# EasyEDA Pro project 快慢上掉电自动化_3.eprj, board PCB1
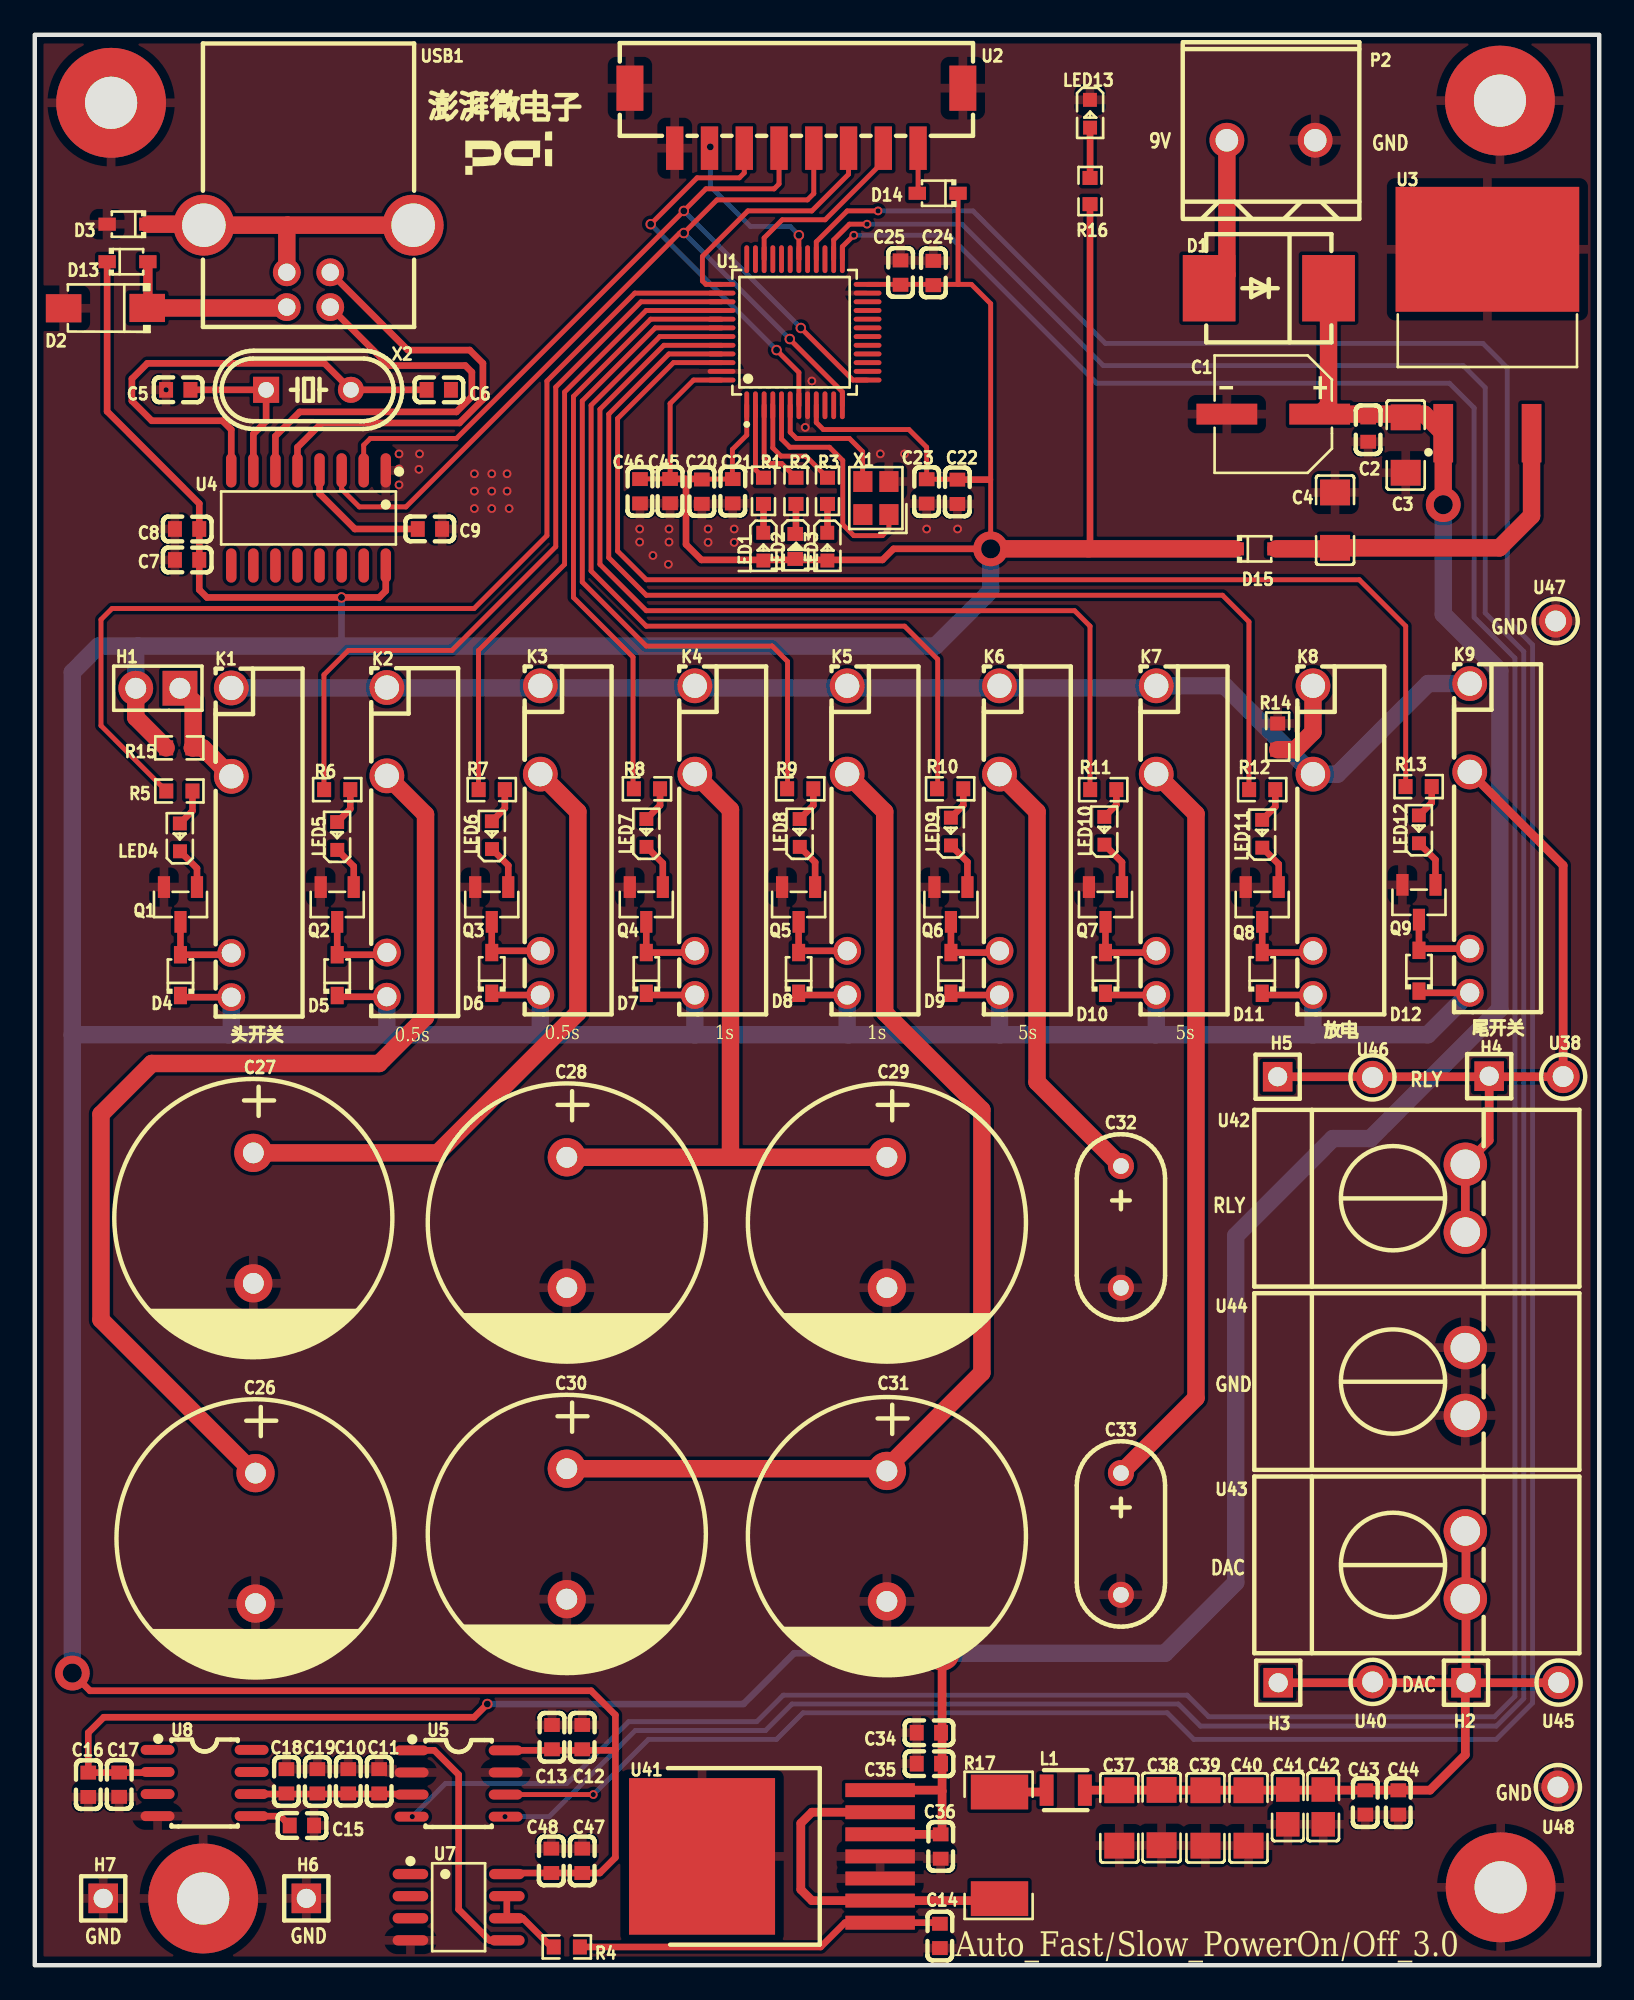
[diagram p6: board, top side]
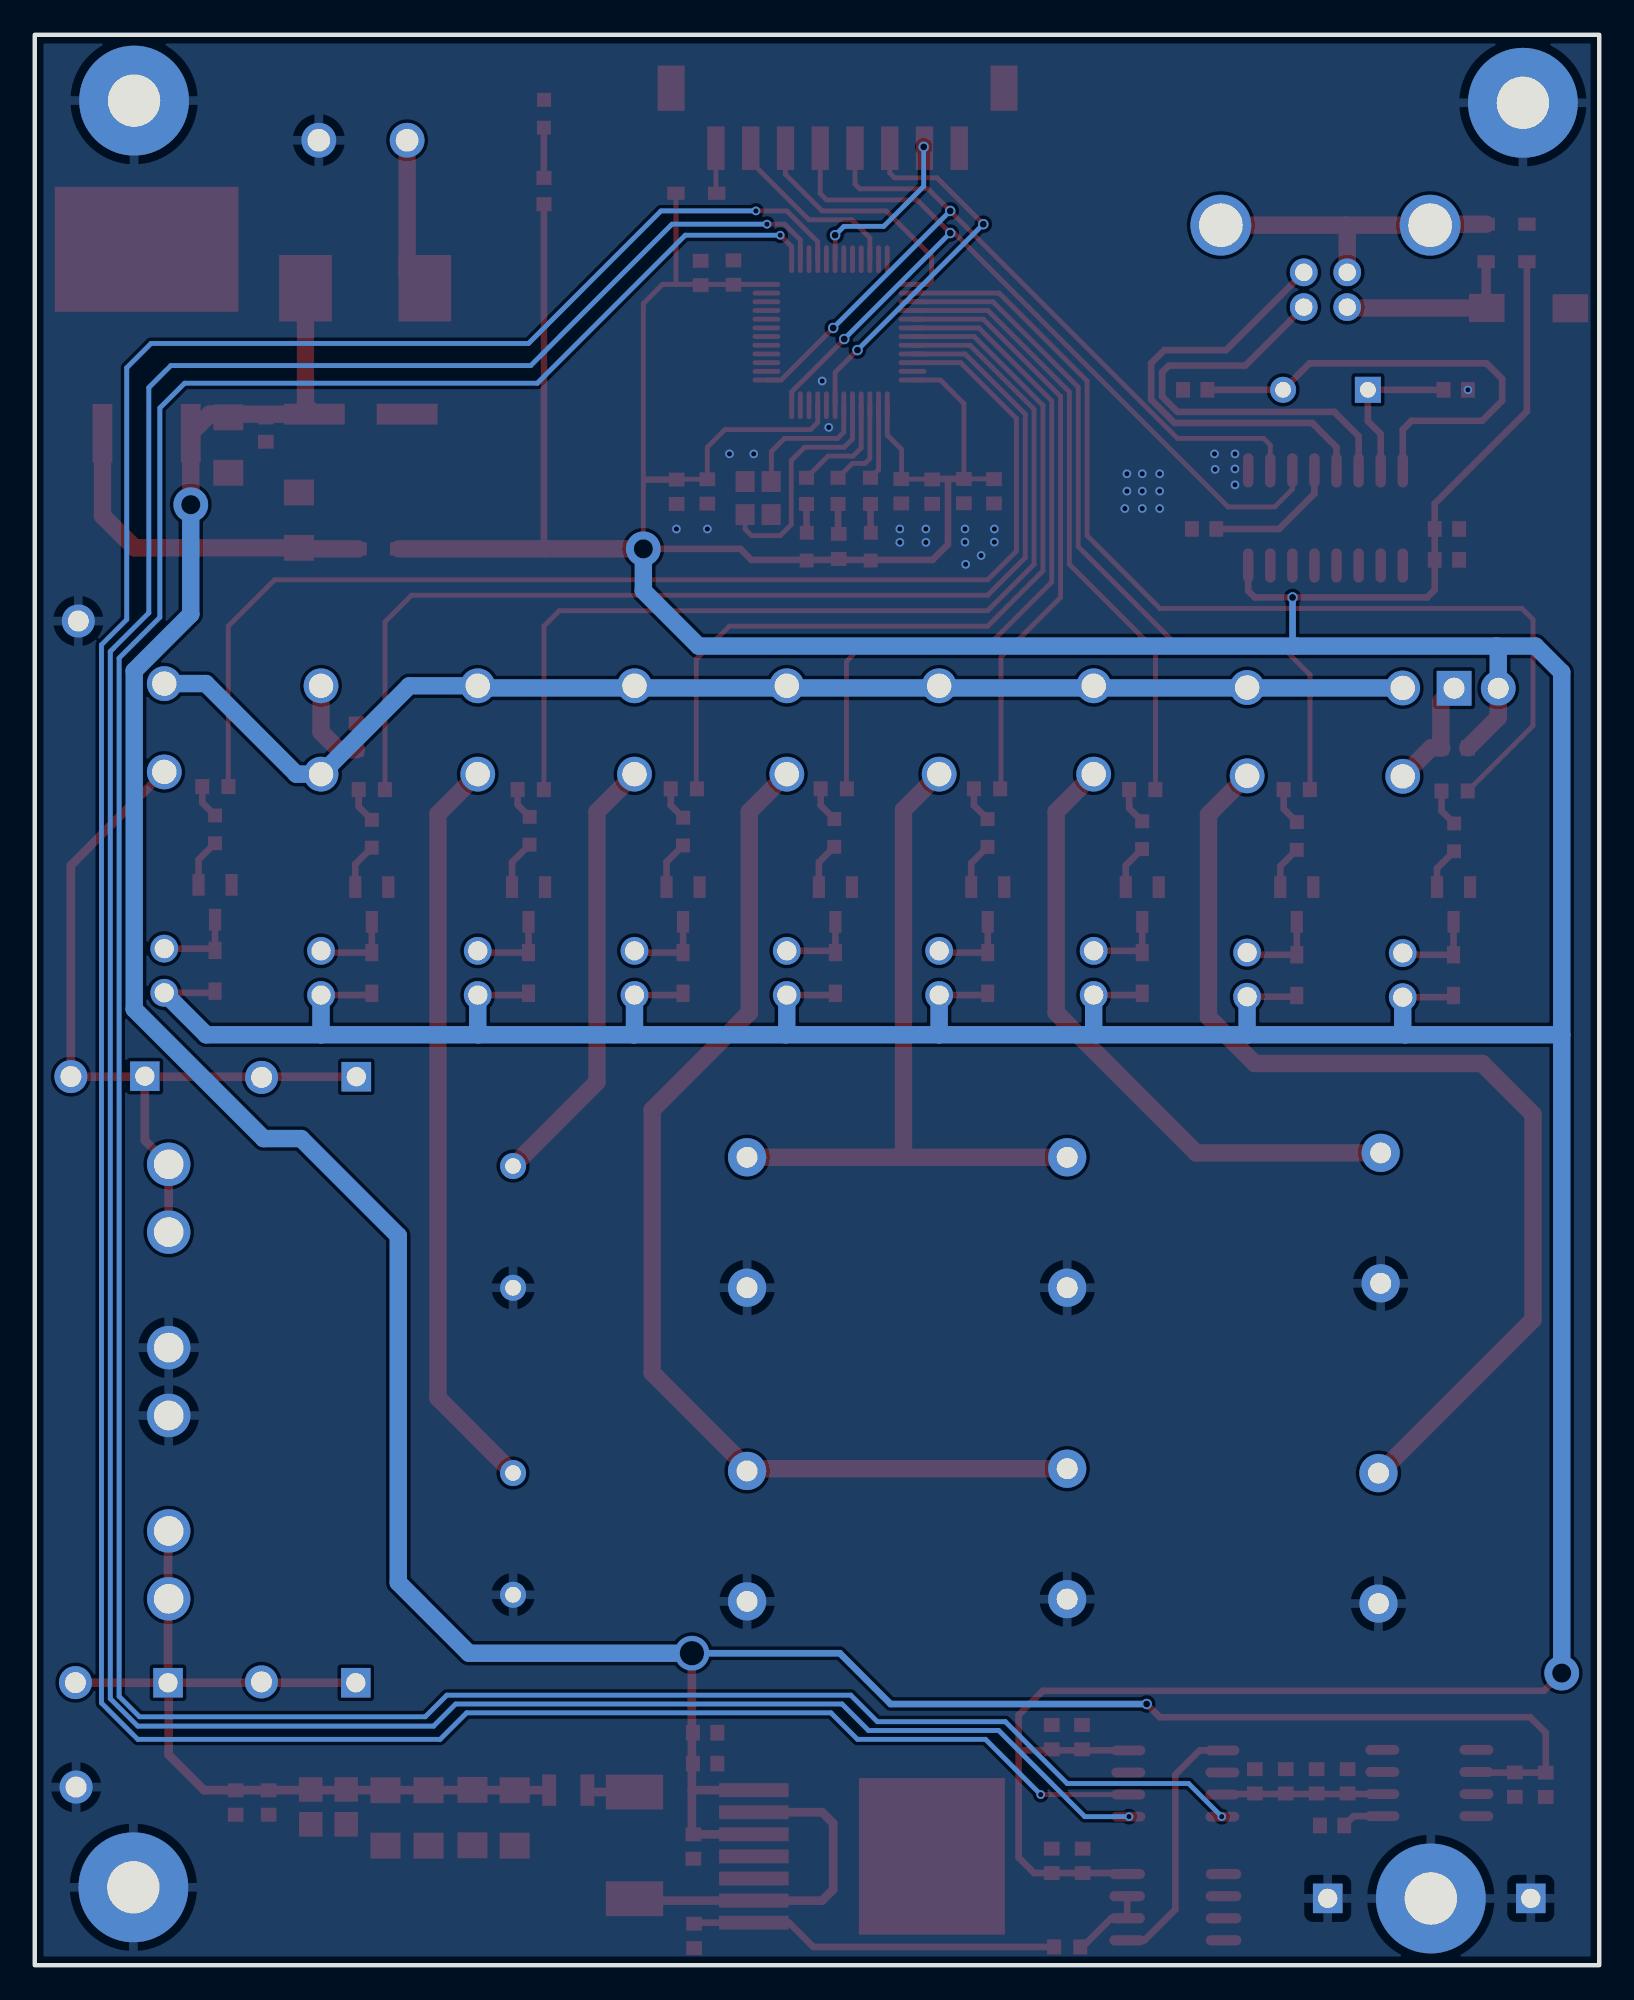
[diagram p7: board, bottom side, seen from below]

Outline 90 x 111 mm; copper layers: Top Layer, Bottom Layer. Coordinates in mm from the lower left corner of the outline.
Outline path: rectangle 0,111 90,0
Stack: Top Layer 0.035mm / Dielectric1 1.51mm FR4 er 4.5 / Bottom Layer 0.035mm

## Design rules (mm)
template: 自定义配置
spacing copperThickness1oz (default): track to track 0.102, other pairs 0.152 to 0.3
spacing copperThickness2oz: track to track 0.203, other pairs 0.152 to 0.3
track width copperThickness1oz (default): min 0.127, default 0.254, max 2.54
track width copperThickness2oz: min 0.203, default 0.254, max 2.54
differential pair differentialPair (default): width min 0.127, default 0.254, max 2.54; gap min 0.152, default 0.152
via viaSize (default): diameter min 0.5, default 0.61, max 10; hole min 0.3, default 0.305, max 6.3

## Placement (name value [footprint] x y rotation side)
C1  100uF  [CAP-SMD_BD6.3-L6.6-W6.6-LS7.6-FD-1]  71.25 89.19 180 top
C2  100nF  [C0603]  76.71 88.3 90 top
C3  10uF  [C1206]  78.87 87.41 90 top
C4  10uF  [C1206]  74.8 83.09 270 top
C5  22pF  [C0603]  8.25 90.58 0 top
C6  22pF  [C0603]  23.24 90.58 180 top
C7  100nF  [C0603]  8.76 80.81 180 top
C8  10uF  [C0603]  8.76 82.58 180 top
C9  100nF  [C0603]  22.73 82.58 0 top
C10  10uF  [C0603]  18.03 10.57 270 top
C11  100nF  [C0603]  19.81 10.57 270 top
C12  10uF  [C0603]  31.5 13.11 90 top
C13  100nF  [C0603]  29.75 13.11 90 top
C14  100nF  [C0603]  52.07 1.68 90 top
C15  1uF  [C0603]  15.37 8.03 180 top
C16  10uF  [C0603]  3.08 10.37 270 top
C17  100nF  [C0603]  4.86 10.38 270 top
C18  10uF  [C0603]  14.48 10.57 90 top
C19  1uF  [C0603]  16.26 10.57 90 top
C20  10uF  [C0603]  38.38 84.73 270 top
C21  100nF  [C0603]  40.15 84.75 270 top
C22  10uF  [C0603]  53.08 84.72 90 top
C23  100nF  [C0603]  51.31 84.74 90 top
C24  10uF  [C0603]  51.69 97.3 270 top
C25  100nF  [C0603]  49.8 97.33 270 top
C26  10000uF  [CAP-TH_BD16.0-P7.50-D1.2-FD]  12.7 24.54 270 top
C27  10000uF  [CAP-TH_BD16.0-P7.50-D1.2-FD]  12.57 42.96 270 top
C28  10000uF  [CAP-TH_BD16.0-P7.50-D1.2-FD]  30.61 42.71 270 top
C29  10000uF  [CAP-TH_BD16.0-P7.50-D1.2-FD]  49.02 42.71 270 top
C30  10000uF  [CAP-TH_BD16.0-P7.50-D1.2-FD]  30.61 24.8 270 top
C31  10000uF  [CAP-TH_BD16.0-P7.50-D1.2-FD]  49.02 24.67 270 top
C32  0.1F  [CAP-TH_L10.5-W5.5-P7.0-D1.0]  62.48 42.45 270 top
C33  0.1F  [CAP-TH_L10.5-W5.5-P7.0-D1.0]  62.48 24.8 270 top
C34  10uF  [C0603]  51.44 13.37 180 top
C35  100nF  [C0603]  51.44 11.59 180 top
C36  100nF  [C0603]  52.11 6.82 270 top
C37  47uF  [C1206]  62.39 8.47 90 top
C38  47uF  [C1206]  64.82 8.49 90 top
C39  100uF  [C1206]  67.35 8.47 90 top
C40  100uF  [C1206]  69.82 8.47 90 top
C41  10uF  [C0805]  72.08 9.1 90 top
C42  10uF  [C0805]  74.12 9.1 90 top
C43  100nF  [C0603]  76.54 9.36 90 top
C44  100nF  [C0603]  78.44 9.36 90 top
C45  100nF  [C0603]  36.55 84.76 90 top
C46  10uF  [C0603]  34.82 84.75 90 top
C47  10uF  [C0603]  31.5 6 90 top
C48  100nF  [C0603]  29.72 6 90 top
D1  SS36-E3/57T  [SMC_L7.1-W6.2-LS8.1-R-RD]  70.99 96.43 180 top
D2  SMAJ5.0A  [SMA_L4.3-W2.6-LS5.0-RD]  4.06 95.28 180 top
D3  1N5819WS  [SOD-323_L1.8-W1.3-LS2.5-RD]  5.33 100.11 180 top
D4  1N4148WS  [SOD-323_L1.8-W1.3-LS2.5-RD]  8.38 56.93 90 top
D5  1N4148WS  [SOD-323_L1.8-W1.3-LS2.5-RD]  17.4 56.93 90 top
D6  1N4148WS  [SOD-323_L1.8-W1.3-LS2.5-RD]  26.29 57.06 90 top
D7  1N4148WS  [SOD-323_L1.8-W1.3-LS2.5-RD]  35.18 57.06 90 top
D8  1N4148WS  [SOD-323_L1.8-W1.3-LS2.5-RD]  43.94 57.06 90 top
D9  1N4148WS  [SOD-323_L1.8-W1.3-LS2.5-RD]  52.7 57.06 90 top
D10  1N4148WS  [SOD-323_L1.8-W1.3-LS2.5-RD]  61.59 57.06 90 top
D11  1N4148WS  [SOD-323_L1.8-W1.3-LS2.5-RD]  70.61 57.06 90 top
D12  1N4148WS  [SOD-323_L1.8-W1.3-LS2.5-RD]  79.63 57.18 90 top
D13  1N5819WS  [SOD-323_L1.8-W1.3-LS2.5-RD]  5.33 97.95 0 top
D14  1N5819WS  [SOD-323_L1.8-W1.3-LS2.5-RD]  51.94 101.89 180 top
D15  1N5819WS  [SOD-323_L1.8-W1.3-LS2.5-RD]  70.23 81.44 0 top
H1  PZ254V-11-02P  [HDR-TH_2P-P2.54-V-M]  7.08 73.43 180 top
H2  PZ254V-11-01P  [HDR-TH_1P-P2.54-V-M]  82.33 16.24 0 top
H3  PZ254V-11-01P  [HDR-TH_1P-P2.54-V-M]  71.53 16.24 0 top
H4  PZ254V-11-01P  [HDR-TH_1P-P2.54-V-M]  83.67 51.12 0 top
H5  PZ254V-11-01P  [HDR-TH_1P-P2.54-V-M]  71.5 51.09 0 top
H6  PZ254V-11-01P  [HDR-TH_1P-P2.54-V-M]  15.62 3.84 0 top
H7  PZ254V-11-01P  [HDR-TH_1P-P2.54-V-M]  3.94 3.84 0 top
J2  -  [DEMO板安装孔]  84.29 107.22 0 top
J3  -  [DEMO板安装孔]  84.33 4.48 0 top
J4  -  [DEMO板安装孔]  9.69 3.84 0 top
J5  -  [DEMO板安装孔]  4.39 107.09 0 top
K1  HF49FD/005-1H11  [RELAY-TH_HF49FD-XXX-1H11-XXX]  11.3 64.55 90 top
K2  HF49FD/005-1H11  [RELAY-TH_HF49FD-XXX-1H11-XXX]  20.26 64.58 90 top
K3  HF49FD/005-1H11  [RELAY-TH_HF49FD-XXX-1H11-XXX]  29.08 64.68 90 top
K4  HF49FD/005-1H11  [RELAY-TH_HF49FD-XXX-1H11-XXX]  37.97 64.68 90 top
K5  HF49FD/005-1H11  [RELAY-TH_HF49FD-XXX-1H11-XXX]  46.74 64.68 90 top
K6  HF49FD/005-1H11  [RELAY-TH_HF49FD-XXX-1H11-XXX]  55.5 64.68 90 top
K7  HF49FD/005-1H11  [RELAY-TH_HF49FD-XXX-1H11-XXX]  64.52 64.68 90 top
K8  HF49FD/005-1H11  [RELAY-TH_HF49FD-XXX-1H11-XXX]  73.53 64.68 90 top
K9  HF49FD/005-1H11  [RELAY-TH_HF49FD-XXX-1H11-XXX]  82.55 64.8 90 top
L1  10uH  [IND-SMD_L2.5-W1.8]  59.31 10.07 0 top
LED1  NCD0603R1  [LED0603-RD_RED]  41.91 81.57 270 top
LED2  19-217/BHC-ZL1M2RY/3T  [LED0603-FD_BLUE]  43.75 81.58 270 top
LED3  19-217/GHC-YR1S2/3T  [LED0603-RD]  45.59 81.57 270 top
LED4  19-217/GHC-YR1S2/3T  [LED0603-RD]  8.35 64.85 90 top
LED5  19-217/GHC-YR1S2/3T  [LED0603-RD]  17.4 64.93 90 top
LED6  19-217/GHC-YR1S2/3T  [LED0603-RD]  26.3 64.98 90 top
LED7  19-217/GHC-YR1S2/3T  [LED0603-RD]  35.19 65.1 90 top
LED8  19-217/GHC-YR1S2/3T  [LED0603-RD]  44.01 65.1 90 top
LED9  19-217/GHC-YR1S2/3T  [LED0603-RD]  52.7 65.18 90 top
LED10  19-217/GHC-YR1S2/3T  [LED0603-RD]  61.53 65.23 90 top
LED11  19-217/GHC-YR1S2/3T  [LED0603-RD]  70.61 65.06 90 top
LED12  19-217/GHC-YR1S2/3T  [LED0603-RD]  79.63 65.31 90 top
LED13  19-217/GHC-YR1S2/3T  [LED0603-RD]  60.71 106.46 270 top
P2  WJ500V-5.08-2P  [CONN-TH_2P-P5.00_WJ500V-5.08-2P]  71.12 104.94 0 top
Q1  SS8050  [SOT-23-3_L2.9-W1.3-P1.90-LS2.4-BR]  8.38 60.99 90 top
Q2  SS8050  [SOT-23-3_L2.9-W1.3-P1.90-LS2.4-BR]  17.4 60.99 90 top
Q3  SS8050  [SOT-23-3_L2.9-W1.3-P1.90-LS2.4-BR]  26.29 60.99 90 top
Q4  SS8050  [SOT-23-3_L2.9-W1.3-P1.90-LS2.4-BR]  35.18 60.99 90 top
Q5  SS8050  [SOT-23-3_L2.9-W1.3-P1.90-LS2.4-BR]  43.94 60.99 90 top
Q6  SS8050  [SOT-23-3_L2.9-W1.3-P1.90-LS2.4-BR]  52.7 60.99 90 top
Q7  SS8050  [SOT-23-3_L2.9-W1.3-P1.90-LS2.4-BR]  61.59 60.99 90 top
Q8  SS8050  [SOT-23-3_L2.9-W1.3-P1.90-LS2.4-BR]  70.61 60.99 90 top
Q9  SS8050  [SOT-23-3_L2.9-W1.3-P1.90-LS2.4-BR]  79.63 61.12 90 top
R1  10kΩ  [R0603]  41.92 84.78 270 top
R2  10kΩ  [R0603]  43.79 84.78 270 top
R3  10kΩ  [R0603]  45.6 84.78 270 top
R4  22Ω  [R0603]  30.61 1.05 0 top
R5  10kΩ  [R0603]  8.32 67.52 0 top
R6  10kΩ  [R0603]  17.4 67.6 0 top
R7  10kΩ  [R0603]  26.29 67.6 0 top
R8  10kΩ  [R0603]  35.22 67.64 0 top
R9  10kΩ  [R0603]  44.04 67.64 0 top
R10  10kΩ  [R0603]  52.66 67.64 0 top
R11  10kΩ  [R0603]  61.47 67.6 0 top
R12  10kΩ  [R0603]  70.61 67.6 0 top
R13  10kΩ  [R0603]  79.61 67.77 0 top
R14  0Ω  [R0603]  71.5 70.65 270 top
R15  100Ω  [R0603]  8.31 70 0 top
R16  10kΩ  [R0603]  60.71 102.01 270 top
R17  10mΩ  [RES-SMD_L6.4-W3.2-R2512]  55.5 6.89 90 top
U1  PT32A030C8T7  [LQFP-48_7.0X7.0X0.5P]  43.71 93.9 0 top
U2  A2008WV-S-8P  [CONN-SMD_A2008WV-S-8P]  43.81 106.21 180 top
U3  L7805CD2T-TR  [TO-263-2_L10.0-W9.1-P5.08-LS15.2-TL]  83.57 93.38 90 top
U4  CH340G  [SOIC-16_L9.9-W3.9-P1.27-LS6.0-BL]  15.75 83.22 180 top
U5  AD5541ARZ-REEL7  [SOIC-8_L5.0-W4.0-P1.27-LS6.0-BL]  24.38 10.45 270 top
U7  OPA2350UA/2K5  [SOIC-8_L4.9-W3.9-P1.27-LS6.0-BL]  24.38 3.34 270 top
U8  REF5050AIDR  [SOIC-8_L5.0-W4.0-P1.27-LS6.0-BL]  9.77 10.48 270 top
U38  RH-5000  [TEST-TH_BD2.54-P1.4_RED]  87.92 51.1 0 top
U40  RH-5000  [TEST-TH_BD2.54-P1.4_RED]  76.96 16.29 0 top
U41  OPA548F/500  [TO-263-7_L10.2-W10.4-P1.27-LS14.4-TL]  43.51 6.26 180 top
U42  DB136HB-10.16-1P-S  [CONN-TH_DIBO_DB136HB-10.16-1P-S]  82.3 44.1 90 top
U43  DB136HB-10.16-1P-S  [CONN-TH_DIBO_DB136HB-10.16-1P-S]  82.3 23.02 90 top
U44  DB136HB-10.16-1P-S  [CONN-TH_DIBO_DB136HB-10.16-1P-S]  82.3 33.56 90 top
U45  RH-5000  [TEST-TH_BD2.54-P1.4_RED]  87.66 16.25 0 top
U46  RH-5000  [TEST-TH_BD2.54-P1.4_RED]  76.95 51.05 0 top
U47  RH-5000  [TEST-TH_BD2.54-P1.4_RED]  87.5 77.29 0 top
U48  RH-5000  [TEST-TH_BD2.54-P1.4_RED]  87.62 10.24 0 top
USB1  USB-B10-BRW  [USB-B-TH_USB-B10-BRW]  15.75 97.7 180 top
X1  25MHz  [OSC-SMD_4P-L2.5-W2.0-BL]  48.39 84.36 90 top
X2  12MHz  [HC-49US_L11.5-W4.5-P4.88]  15.75 90.58 0 top

## Footprints (pads in the part's own frame, mm; a bottom-side part is the same pattern mirrored in y, then rotated)
C0603
  rect 0.8x0.9 smd: 1(-0.7,0) 2(0.7,0)
C0805
  rect 1.41x1.35 smd: 1(-1,0) 2(1,0)
C1206
  rect 1.485x1.728 smd: 1(-1.593,0) 2(1.593,0)
CAP-SMD_BD6.3-L6.6-W6.6-LS7.6-FD-1
  rect 3.5x1.2 smd: 1(-2.67,0) 2(2.67,0)
CAP-TH_BD16.0-P7.50-D1.2-FD
  round 2.2 hole 1.2: 1(-3.75,0) 2(3.75,0)
CAP-TH_L10.5-W5.5-P7.0-D1.0
  round 1.5 hole 0.9: 1(-3.5,0) 2(3.5,0)
CONN-SMD_A2008WV-S-8P
  rect 1x2.5 smd: 1(-7,1.724) 2(-5,1.724) 3(-3,1.724) 4(-1,1.724) 5(1,1.724) 6(2.999,1.724) 7(5,1.724) 8(7,1.724)
  rect 1.55x2.6 smd: 9(-9.575,-1.724) 10(9.575,-1.724)
CONN-TH_2P-P5.00_WJ500V-5.08-2P
  round 2 hole 1.3: 1(-2.54,0) 2(2.54,0)
CONN-TH_DIBO_DB136HB-10.16-1P-S
  round 2.5 hole 1.7: 1(-1.95,0) 2(1.95,0)
DEMO板安装孔
  round 6.32 hole 3: 1(0,0)
HC-49US_L11.5-W4.5-P4.88
  rect 1.5x1.5 hole 0.9: 1(-2.44,0)
  round 1.5 hole 0.9: 2(2.44,0)
HDR-TH_1P-P2.54-V-M
  rect 1.7x1.7 hole 1.1: 1(0,0)
HDR-TH_2P-P2.54-V-M
  rect 2x2 hole 1.2: 1(-1.27,0)
  round 2 hole 1.2: 2(1.27,0)
IND-SMD_L2.5-W1.8
  rect 0.8x1.8 smd: 1(-1.1,0) 2(1.1,0)
LED0603-FD_BLUE
  rect 0.8x0.9 smd: 1(-0.72,0) 2(0.72,0)
LED0603-RD
  rect 0.8x0.8 smd: 1(-0.799,-0.004) 2(0.799,0.004)
LED0603-RD_RED
  rect 0.8x0.8 smd: 1(-0.799,-0.004) 2(0.799,0.004)
LQFP-48_7.0X7.0X0.5P
  oval 0.28x1.6 smd: 1(-2.75,-4.2) 2(-2.25,-4.2) 3(-1.75,-4.2) 4(-1.25,-4.2) 5(-0.75,-4.2) 6(-0.25,-4.2) 7(0.25,-4.2) 8(0.75,-4.2) 9(1.25,-4.2) 10(1.75,-4.2) 11(2.25,-4.2) 12(2.75,-4.2) 25(2.75,4.2) 26(2.25,4.2) 27(1.75,4.2) 28(1.25,4.2) 29(0.75,4.2) 30(0.25,4.2) 31(-0.25,4.2) 32(-0.75,4.2) 33(-1.25,4.2) 34(-1.75,4.2) 35(-2.25,4.2) 36(-2.75,4.2)
  oval 1.6x0.28 smd: 13(4.2,-2.75) 14(4.2,-2.25) 15(4.2,-1.75) 16(4.2,-1.25) 17(4.2,-0.75) 18(4.2,-0.25) 19(4.2,0.25) 20(4.2,0.75) 21(4.2,1.25) 22(4.2,1.75) 23(4.2,2.25) 24(4.2,2.75) 37(-4.2,2.75) 38(-4.2,2.25) 39(-4.2,1.75) 40(-4.2,1.25) 41(-4.2,0.75) 42(-4.2,0.25) 43(-4.2,-0.25) 44(-4.2,-0.75) 45(-4.2,-1.25) 46(-4.2,-1.75) 47(-4.2,-2.25) 48(-4.2,-2.75)
OSC-SMD_4P-L2.5-W2.0-BL
  rect 1.2x1.1 smd: 1(-0.95,-0.75) 2(0.95,-0.75) 3(0.95,0.75) 4(-0.95,0.75)
R0603
  rect 0.806x0.864 smd: 1(-0.753,0) 2(0.753,0)
RELAY-TH_HF49FD-XXX-1H11-XXX
  round 1.6 hole 1.1: 1(-8.89,0) 2(-6.35,0)
  round 2 hole 1.4: 3(3.81,0) 4(8.89,0)
RES-SMD_L6.4-W3.2-R2512
  rect 2x3.3 smd: 1(-3.067,0) 2(3.067,0)
SMA_L4.3-W2.6-LS5.0-RD
  rect 2.046x1.62 smd: 1(-2.404,-0.009) 2(2.404,0.009)
SMC_L7.1-W6.2-LS8.1-R-RD
  rect 3.03x3.82 smd: 1(3.435,0) 2(-3.435,0)
SOD-323_L1.8-W1.3-LS2.5-RD
  rect 1x0.75 smd: 1(-1.173,0) 2(1.173,0)
SOIC-8_L4.9-W3.9-P1.27-LS6.0-BL
  oval 0.588x2.045 smd: 1(-1.905,-2.772) 2(-0.635,-2.772) 3(0.635,-2.772) 4(1.905,-2.772) 5(1.905,2.772) 6(0.635,2.772) 7(-0.635,2.772) 8(-1.905,2.772)
SOIC-8_L5.0-W4.0-P1.27-LS6.0-BL
  oval 0.569x1.95 smd: 1(-1.905,-2.705) 2(-0.635,-2.705) 3(0.635,-2.705) 4(1.905,-2.705) 5(1.905,2.705) 6(0.635,2.705) 7(-0.635,2.705) 8(-1.905,2.705)
SOIC-16_L9.9-W3.9-P1.27-LS6.0-BL
  oval 0.602x1.971 smd: 1(-4.445,-2.736) 2(-3.175,-2.736) 3(-1.905,-2.736) 4(-0.635,-2.736) 5(0.635,-2.736) 6(1.905,-2.736) 7(3.175,-2.736) 8(4.445,-2.736) 9(4.445,2.736) 10(3.175,2.736) 11(1.905,2.736) 12(0.635,2.736) 13(-0.635,2.736) 14(-1.905,2.736) 15(-3.175,2.736) 16(-4.445,2.736)
SOT-23-3_L2.9-W1.3-P1.90-LS2.4-BR
  rect 1.25x0.7 smd: 1(1,-0.95) 2(1,0.95) 3(-1,0)
TEST-TH_BD2.54-P1.4_RED
  round 1.9 hole 1.2: 1(0,0)
TO-263-2_L10.0-W9.1-P5.08-LS15.2-TL
  rect 3.358x1.134 smd: 1(-5.286,2.54) 3(-5.286,-2.54)
  rect 7.181x10.566 smd: 4(5.286,0)
TO-263-7_L10.2-W10.4-P1.27-LS14.4-TL
  rect 4x0.8 smd: 1(-5.122,3.81) 2(-5.122,2.54) 3(-5.122,1.27) 4(-5.122,0) 5(-5.122,-1.27) 6(-5.122,-2.54) 7(-5.122,-3.81)
  rect 8.4x9 smd: 8(5.122,0)
USB-B-TH_USB-B10-BRW
  round 1.6 hole 1: 1(1.25,2.355) 2(-1.25,2.355) 3(-1.25,0.355) 4(1.25,0.355)
  round 3.5 hole 2.5: 5(-6.02,-2.355) 6(6.02,-2.355)

## Nets
As in the schematic.

Pads without a net: U1 10 11 14 15 16 17 18 19 20 21 22 27 29 31 32 33 35 36; U4 9 10 11 12 13 14 15; U7 1 2 3; U8 1 3 7 8

## Via types
v1: diameter 2, hole 1.1, Top Layer to Bottom Layer, 3 vias
v2: diameter 0.6, hole 0.4, Top Layer to Bottom Layer, 10 vias
v3: diameter 0.5, hole 0.3, Top Layer to Bottom Layer, 37 vias
v4: diameter 2, hole 1.4, Top Layer to Bottom Layer, 1 via

## Routing (per net, layer and track width the routed paths; a pad name or vN(x,y) marks a point on that pad's centre or on a via; arc(x,y) is an arc through that point)
GND:
  vias: v3(7.55,90.58) v3(20.95,86.9) v3(20.95,86.04) v3(20.95,85.12) v3(22.1,86.01) v3(22.13,86.9) v3(25.29,85.76) v3(25.29,84.76) v3(25.29,83.76) v3(26.29,85.76) v3(26.29,84.76) v3(26.29,83.76) v3(27.17,85.76) v3(27.17,84.76) v3(27.29,83.76) v3(34.8,82.58) v3(34.8,81.83) v3(35.56,81.06) v3(36.49,82.58) v3(36.49,81.83) v3(36.45,80.55) v3(38.73,82.58) v3(38.73,81.81) v3(40.23,82.58) v3(40.23,81.81) v3(44.32,88.43) v3(44.7,91.09) v3(48.64,86.9) v3(50.03,86.9) v3(51.31,82.58) v3(53.09,82.58)
DAC_OUT: length 14.5
  Top Layer w0.38: 21.68,12.35 22.99,12.35 24.38,10.96 24.38,3.21 26.16,1.43 U7.5
DAC_OUT_VCC: length 51.8
  Top Layer w0.5: L1.2 80.26,10.07 82.3,12.1 82.3,16.2 H2.1 ; U43.2 82.33,24.93 H2.1 ; H2.1 H3.1 ; H2.1 87.65,16.24 U45.1
DC_9V: length 183.4
  Top Layer w0.38: v2(26.03,15.02) 25.27,14.26 3.97,14.26 3.08,13.37 C16.1 7.03,11.07 U8.2
  Top Layer w0.5: U41.5 52.11,7.53 52.11,7.52 52.2,7.61 52.2,10.02 ; 52.2,10.02 52.15,10.07 U41.7 ; 52.2,10.02 v4(52.2,17.94)
  Top Layer w1: D1.2 74.43,89.7 73.92,89.19 79.93,89.19 U3.1 v1(81.03,83.98)
  Bottom Layer w0.38: v4(52.2,17.94) 43.69,17.94 40.77,15.02 v2(26.03,15.02)
  Bottom Layer w1: v1(81.03,83.98) 81.03,77.68 84.28,74.43 84.28,54.98 76.83,47.53 74.68,47.53 69.09,41.94 69.09,22 65.02,17.94 v4(52.2,17.94)
DUT_VCC_RLY: length 45.7
  Top Layer w0.5: H5.1 83.67,51.09 ; 83.67,51.09 83.67,47.43 U42.2 U42.1 ; 83.67,51.09 H4.1 ; 83.67,51.09 87.91,51.09 U38.1 87.92,63.24 K9.3
LDO_5V: length 450.9
  Top Layer w0.28: C20.1 38.4,85.45 C21.1 40.13,85.47 40.13,87.16 40.96,87.98 U1.1 ; 53.08,85.42 53.05,85.44 C23.2 51.31,87.28 50.29,88.3 45.37,88.3 44.96,88.71 U1.9 ; D14.1 53.12,96.66 53.13,96.65 ; v1(54.99,81.44) 54.99,95.54 53.88,96.65 53.13,96.65 ; C46.2 34.83,85.46 C45.2 36.55,89.8 37.9,91.15 U1.48 ; 53.13,96.65 U1.24
  Top Layer w0.38: D13.1 4.16,89.34 9.46,84.04 C8.1 C7.1 9.46,79.09 9.91,78.65 v2(17.64,78.65) 19.81,78.65 20.19,79.03 20.19,80.48 ; K4.1 35.28,55.79 D7.1 ; K5.1 44.04,55.79 D8.1 ; C45.2 37.39,85.46 ; 37.39,85.46 38.34,85.46 C20.1 ; 37.39,85.46 37.47,85.39 37.47,81.69 38.35,80.81 48.77,80.81 49.4,81.44 v1(54.99,81.44) ; K1.1 8.48,55.66 D4.1 ; 33.4,12.38 33.4,6.19 32.51,5.3 C47.1 C48.1 27.22,5.3 U7.8 ; 33.4,12.38 33.38,12.35 U5.8 ; 33.4,12.38 33.4,14.38 32,15.78 3.17,15.78 v1(2.16,16.8) ; D5.1 17.47,55.69 K2.1 ; K8.1 70.71,55.79 D11.1 ; K7.1 61.69,55.79 D10.1 ; 53.08,85.42 54.94,85.42 ; D6.1 26.39,55.79 K3.1 ; K9.1 79.73,55.91 D12.1 ; 60.62,81.44 60.71,81.53 R16.2 ; K6.1 52.8,55.79 D9.1
  Top Layer w1: v1(54.99,81.44) D15.1 ; R15.1 5.81,71.75 H1.2
  Bottom Layer w0.38: 17.49,75.85 17.64,76.01 v2(17.64,78.65)
  Bottom Layer w1: K6.1 55.5,53.53 55.53,53.5 ; K9.1 80.14,53.5 73.52,53.5 ; K4.1 37.97,53.51 37.96,53.5 ; H1.2 5.81,75.74 5.92,75.85 ; 5.92,75.85 3.67,75.85 2.16,74.34 2.16,53.5 ; 5.92,75.85 51.82,75.85 54.99,79.03 v1(54.99,81.44) ; 37.96,53.5 46.8,53.5 ; 37.96,53.5 28.95,53.5 ; 46.8,53.5 55.53,53.5 ; 46.8,53.5 46.74,53.57 K5.1 ; 2.16,53.5 11.16,53.5 ; 2.16,53.5 v1(2.16,16.8) ; 11.16,53.5 20.19,53.5 ; 11.16,53.5 11.3,53.65 K1.1 ; 20.19,53.5 28.95,53.5 ; 20.19,53.5 20.26,53.57 K2.1 ; 55.53,53.5 64.48,53.5 ; K3.1 29.08,53.64 28.95,53.5 ; 73.52,53.5 73.53,53.51 K8.1 ; 73.52,53.5 64.48,53.5 ; 64.48,53.5 64.52,53.54 K7.1
LED_BLUE: length 5.4
  Top Layer w0.28: U1.3 41.96,86.63 42.24,86.35 42.97,86.35 R2.1
LED_GREEN: length 6.3
  Top Layer w0.28: R3.1 44.36,86.77 42.93,86.77 42.46,87.24 U1.4
LED_RED: length 4.4
  Top Layer w0.28: U1.2 41.46,85.99 R1.1
MCO: length 10
  Top Layer w0.28: U2.7 38.86,104.53 v2(38.86,104.55) ; U1.30 v2(43.96,99.47)
  Bottom Layer w0.28: v2(38.86,104.55) 38.86,102.28 41.16,99.98 43.45,99.98 v2(43.96,99.47)
OPA1_OUT_VCC: length 21.3
  Top Layer w0.38: C14.2 52.01,2.45 U41.1 46.61,2.45 45.21,1.05 R4.2
OSC_IN: length 13.6
  Top Layer w0.28: U1.5 42.96,87.76 43.43,87.28 45.72,87.28 46.48,86.52 46.48,82.84 47.12,82.2 48.77,82.2 49.14,82.57 X1.1
OSC_OUT: length 7.9
  Top Layer w0.28: X1.3 47.62,85.32 47.62,87.03 46.86,87.79 43.81,87.79 43.46,88.15 U1.6
REF_5V: length 9.2
  Top Layer w0.38: U8.6 21.65,9.84 21.68,9.81
RLY1_CTRL: length 60.1
  Top Layer w0.28: R5.1 3.81,71.27 3.81,77.38 4.44,78.01 25.27,78.01 29.46,82.2 29.46,91.09 34.52,96.15 U1.38
RLY2_CTRL: length 43.7
  Top Layer w0.28: R6.1 16.64,67.61 16.64,74.2 18.03,75.6 24,75.6 29.97,81.57 29.97,90.74 34.88,95.65 U1.39
RLY3_CTRL: length 35.9
  Top Layer w0.28: U1.40 35.17,95.15 30.48,90.46 30.48,80.55 25.53,75.6 25.53,67.61 R7.1
RLY4_CTRL: length 34.4
  Top Layer w0.28: 34.47,67.64 34.42,67.69 34.42,75.22 30.99,78.65 30.99,90.2 35.43,94.65 U1.41
RLY5_CTRL: length 41.2
  Top Layer w0.28: R9.1 43.31,67.67 43.31,74.96 42.42,75.85 35.18,75.85 31.5,79.54 31.5,89.95 35.69,94.15 U1.42
RLY6_CTRL: length 48.2
  Top Layer w0.28: U1.43 35.96,93.65 32,89.7 32,80.17 35.18,77 50.04,77 51.94,75.09 51.94,67.68 R10.1
RLY7_CTRL: length 56.5
  Top Layer w0.28: U1.44 36.19,93.15 32.51,89.47 32.51,80.55 35.18,77.88 59.82,77.88 60.71,77 60.71,67.61 R11.1
RLY8_CTRL: length 64.2
  Top Layer w0.28: R12.1 69.85,67.61 69.85,77.25 68.33,78.77 35.18,78.77 33.02,80.93 33.02,89.19 36.48,92.65 U1.45
RLY9_CTRL: length 71.3
  Top Layer w0.28: R13.1 78.87,67.78 78.87,77 76.2,79.66 35.18,79.66 33.53,81.31 33.53,88.93 36.74,92.15 U1.46
RSTN: length 22
  Top Layer w0.28: v2(42.67,92.87) 43.96,91.58 U1.7 ; v2(35.43,100.11) 38.1,102.78 40.54,102.78 40.82,103.06 U2.6
  Bottom Layer w0.28: v2(42.67,92.87) v2(35.43,100.11)
SPI_CS: length 183.9
  Top Layer w0.28: v3(47.12,99.47) 46.46,98.82 U1.25 ; v3(21.72,8.54) 21.68,8.54
  Bottom Layer w0.28: v3(21.72,8.54) 23.62,10.45 30.61,10.45 34.16,14 41.53,14 43.05,15.53 66.29,15.53 67.53,14.29 83.98,14.29 85.15,15.46 85.15,75.16 82.8,77.5 82.8,89.54 81.38,90.97 61.09,90.97 52.58,99.47 v3(47.12,99.47)
SPI_MOSI: length 185.1
  Top Layer w0.28: U5.6 v3(32.13,9.81) ; v3(48.51,100.87) 46.74,100.87 44.96,99.09 U1.28
  Bottom Layer w0.28: v3(32.13,9.81) 35.31,12.99 42.67,12.99 44.2,14.51 65.15,14.51 66.67,12.99 84.07,12.99 86.16,15.08 86.16,75.92 84.71,77.38 84.71,91.85 83.31,93.25 61.59,93.25 53.97,100.87 v3(48.51,100.87)
SPI_SCK: length 181.7
  Top Layer w0.28: v3(47.88,100.11) 46.86,100.11 45.96,99.2 U1.26 ; v3(27.05,8.54) U5.5
  Bottom Layer w0.28: v3(47.88,100.11) 53.34,100.11 61.47,91.98 82.17,91.98 83.44,90.71 83.44,77.76 85.66,75.54 85.66,15.33 84.07,13.75 67.06,13.75 65.79,15.02 43.56,15.02 42.04,13.5 34.54,13.5 29.59,8.54 v3(27.05,8.54)
SWCLK: length 14.5
  Top Layer w0.28: U2.3 46.81,102.98 44.7,100.87 41.02,100.87 38.41,98.26 38.41,96.85 38.61,96.65 U1.37
SWDIO: length 10.7
  Top Layer w0.28: U1.34 41.96,99.32 43,100.36 45.47,100.36 48.81,103.71 U2.2
UART_RX: length 48.2
  Top Layer w0.28: U4.2 18.92,87.41 19.3,87.79 24.26,87.79 v2(37.34,100.87) 38.61,102.14 42.54,102.14 42.82,102.42 U2.5 ; U1.13 47.06,91.15 v2(44.07,94.14)
  Bottom Layer w0.28: v2(44.07,94.14) v2(37.34,100.87)
UART_TX: length 52.4
  Top Layer w0.28: U4.3 17.65,84.87 18.67,83.85 21.35,83.85 37.1,99.6 v2(37.34,99.6) 39.24,101.51 44.45,101.51 44.82,101.87 U2.4 ; U1.12 46.46,90.47 43.43,93.49 v2(43.43,93.51)
  Bottom Layer w0.28: v2(43.43,93.51) v2(37.34,99.6)
USB_D+: length 26.2
  Top Layer w0.38: USB1.3 17,97.34 21.46,92.87 25.02,92.87 25.78,92.11 25.78,90.03 24.43,88.68 16.51,88.68 15.11,87.28 15.11,85.95
USB_D-: length 25.3
  Top Layer w0.38: USB1.2 20.36,91.98 24.77,91.98 25.15,91.6 25.15,90.2 24.26,89.31 15.24,89.31 13.84,87.92 U4.6
$1N739: length 1.7
  Top Layer w0.38: LED3.1 45.6,82.38 R3.2
$1N740: length 1.7
  Top Layer w0.38: R1.2 41.92,82.38 LED1.1
$1N744: length 1.7
  Top Layer w0.38: LED2.1 43.79,82.34 R2.2
$1N7838: length 2.6
  Top Layer w0.28: D14.2 50.81,101.93 U2.1
$2N1943: length 2.4
  Top Layer w0.38: C15.2 14.13,8.57 U8.5
$2N2720: length 2.9
  Top Layer w0.38: R16.1 60.71,102.77 LED13.2
$2N6855: length 20.2
  Top Layer w1: D15.2 74.74,81.44 C4.2 84.26,81.5 86.11,83.35 U3.3
$2N8694: length 8.8
  Top Layer w1: 67.81,96.43 68.58,97.19 P2.1
$3N289: length 10.7
  Top Layer w0.54: D2.1 6.51,95.33 D13.2
  Top Layer w1: USB1.1 14.45,95.29 D2.1
$3N717: length 9.3
  Top Layer w0.38: U4.7 12.57,88.04 13.31,88.78 X2.1 C5.2
$3N720: length 28
  Top Layer w0.38: C6.2 X2.2 16.66,92.11 6.48,92.11 5.59,91.22 5.59,89.95 6.73,88.81 10.79,88.81 11.3,88.3 U4.8
$3N945: length 7.8
  Top Layer w0.38: U4.4 16.38,84.62 18.41,82.58 C9.1
$3N993: length 18
  Top Layer w1: USB1.4 14.5,100 14.55,100.05 ; 14.55,100.05 USB1.5 ; 14.55,100.05 USB1.6 9.67,100.11 D3.1
$5N715: length 4.7
  Top Layer w0.38: U7.7 U7.6 28.08,2.7 29.73,1.05 R4.1
$5N5978: length 20.4
  Top Layer w0.5: U41.6 44.7,8.8 44.07,8.16 44.07,4.35 44.7,3.72 U41.2 55.39,3.72 R17.1
$5N7179: length 2.8
  Top Layer w0.5: R17.2 58.1,9.96 L1.1
$6N2399: length 2.5
  Top Layer w0.38: LED4.1 9.33,63.07 Q1.1
$6N2435: length 2.2
  Top Layer w0.38: LED4.2 9.07,66.38 9.07,67.52
$6N2519: length 2.5
  Top Layer w0.38: LED5.1 18.35,63.18 Q2.1
$6N2555: length 2.2
  Top Layer w0.38: LED5.2 18.15,66.49 R6.2
$6N3018: length 2.1
  Top Layer w0.38: LED6.2 27.04,66.52 R7.2
$6N3020: length 2.6
  Top Layer w0.38: Q3.1 27.24,63.24 LED6.1
$6N3329: length 2.1
  Top Layer w0.38: R8.2 35.97,66.69 LED7.2
$6N3331: length 2.7
  Top Layer w0.38: LED7.1 36.13,63.37 Q4.1
$6N3966: length 2.1
  Top Layer w0.38: R9.2 44.79,66.69 LED8.2
$6N3968: length 2.7
  Top Layer w0.38: Q5.1 44.89,63.42 LED8.1
$6N4277: length 2
  Top Layer w0.38: LED9.2 53.41,66.7 R10.2
$6N4279: length 2.8
  Top Layer w0.38: LED9.1 53.66,63.44 Q6.1
$6N4588: length 1.9
  Top Layer w0.38: R11.2 62.22,66.72 LED10.2
$6N4590: length 2.9
  Top Layer w0.38: Q7.1 62.54,63.42 LED10.1
$6N4862: length 2.7
  Top Layer w0.38: Q8.1 71.56,63.31 LED11.1
$6N4864: length 2.1
  Top Layer w0.38: R12.2 71.37,66.61 LED11.2
$6N7937: length 2.8
  Top Layer w0.38: LED12.1 80.58,63.57 Q9.1
$6N7938: length 2
  Top Layer w0.38: 80.36,67.77 80.36,66.85 LED12.2
$6N8494: length 4.6
  Top Layer w0.38: Q6.3 D9.2 55.4,58.23 K6.2
$6N8516: length 4.7
  Top Layer w0.38: Q7.3 D10.2 64.42,58.23 K7.2
$6N8536: length 4.6
  Top Layer w0.38: K4.2 37.88,58.23 D7.2 Q4.3
$6N8545: length 4.6
  Top Layer w0.38: K3.2 26.39,58.33 D6.2 Q3.3
$6N8554: length 4.8
  Top Layer w0.38: K2.2 20.13,58.1 D5.2 Q2.3
$6N8572: length 4.9
  Top Layer w0.38: Q1.3 D4.2 11.21,58.1 11.3,58.2
$6N13186: length 4.7
  Top Layer w0.38: K9.2 79.73,58.45 D12.2 Q9.3
$6N13204: length 4.7
  Top Layer w0.38: K8.2 73.44,58.23 D11.2 Q8.3
$6N22035: length 6.7
  Top Layer w1: H1.1 9.11,72.66 9.11,70.04 R15.2 9.67,70 K1.3
$6N22240: length 5.1
  Top Layer w1: K8.4 73.53,70.91 72.52,69.89 R14.2
$6N22254: length 75.6
  Bottom Layer w1: K9.4 80.15,73.69 74.95,68.49 K8.3 68.45,73.57 K7.4 64.39,73.44 K1.4
$6N22408: length 60
  Top Layer w1: 12.57,28.29 12.57,28.35 3.81,37.12 3.81,48.93 6.73,51.85 19.81,51.85 22.48,54.52 22.48,66.17 K2.3
$6N22444: length 36.6
  Top Layer w1: C27.1 23.18,46.71 31.24,54.77 31.24,66.33 K3.3
$6N22636: length 41.3
  Top Layer w1: K4.3 40.02,66.44 40.02,46.46 ; 40.02,46.46 C29.1 ; 40.02,46.46 C28.1
$6N22881: length 25.4
  Top Layer w1: K6.3 57.66,66.33 57.66,50.78 C32.1
$6N22920: length 42.9
  Top Layer w1: C33.1 66.8,32.62 66.8,66.2 K7.3
$6N24705: length 64
  Top Layer w1: K5.3 48.89,66.33 48.89,54.77 54.48,49.18 54.48,34.07 49.02,28.61 C31.1 48.89,28.55 C30.1
$6N24706: length 4.6
  Top Layer w0.38: Q5.3 D8.2 44.04,58.33 K5.2

## Copper pours and planes (outline as drawn; the poured copper is in the pictures)
GND on Top Layer: 0,111 90,111 90,0 0,0
GND on Bottom Layer: 0,111 90,111 90,0 0,0

## Text on the board
Top Silkscreen Layer: GND | 9V | DAC | RLY | 澎湃微电子 | Auto_Fast/Slow_PowerOn/Off_3.0 | 头开关 | 0.5s | 1s | 5s | 放电 | 尾开关
